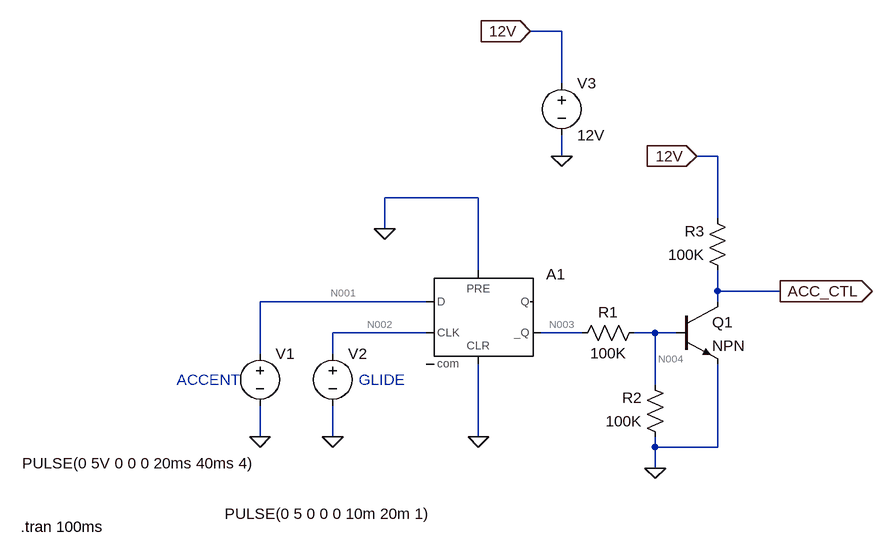
[diagram p0: schematic Accent_1.asc]
Accent_1.asc, the LTspice schematic file:
Version 4
SHEET 1 880 680
WIRE 368 -288 320 -288
WIRE 368 -208 368 -288
WIRE 368 -96 368 -128
WIRE 608 -96 576 -96
WIRE 240 -32 96 -32
WIRE 608 0 608 -96
WIRE 96 16 96 -32
WIRE 240 80 240 -32
WIRE 608 112 608 80
WIRE 704 112 608 112
WIRE 160 128 -96 128
WIRE 608 128 608 112
WIRE 160 176 16 176
WIRE 400 176 336 176
WIRE 512 176 480 176
WIRE 544 176 512 176
WIRE -96 208 -96 128
WIRE 16 208 16 176
WIRE 512 256 512 176
WIRE -96 336 -96 288
WIRE 16 336 16 288
WIRE 240 336 240 224
WIRE 512 352 512 336
WIRE 608 352 608 224
WIRE 608 352 512 352
WIRE 512 384 512 352
FLAG -96 336 0
FLAG 16 336 0
FLAG 240 336 0
FLAG 96 16 0
FLAG 512 384 0
FLAG 368 -96 0
FLAG 320 -288 12V
IOPIN 320 -288 In
FLAG 576 -96 12V
IOPIN 576 -96 In
FLAG 704 112 ACC_CTL
IOPIN 704 112 Out
SYMBOL Digital\\dflop 240 80 R0
WINDOW 3 0 0 Invisible 0
SYMATTR InstName A1
SYMATTR Value Vhigh=5
SYMBOL voltage -96 192 R0
WINDOW 3 -366 185 Left 2
WINDOW 123 0 0 Left 0
WINDOW 39 0 0 Left 0
SYMATTR InstName V1
SYMATTR Value PULSE(0 5V 0 0 0 20ms 40ms 4)
SYMBOL voltage 16 192 R0
WINDOW 3 -166 262 Left 2
WINDOW 123 0 0 Left 0
WINDOW 39 0 0 Left 0
SYMATTR InstName V2
SYMATTR Value PULSE(0 5 0 0 0 10m 20m 1)
SYMBOL res 496 160 R90
WINDOW 0 0 56 VBottom 2
WINDOW 3 32 56 VTop 2
SYMATTR InstName R1
SYMATTR Value 100K
SYMBOL res 528 352 R180
WINDOW 0 36 76 Left 2
WINDOW 3 36 40 Left 2
SYMATTR InstName R2
SYMATTR Value 100K
SYMBOL res 624 96 R180
WINDOW 0 36 76 Left 2
WINDOW 3 36 40 Left 2
SYMATTR InstName R3
SYMATTR Value 100K
SYMBOL npn 544 128 R0
SYMATTR InstName Q1
SYMBOL voltage 368 -224 R0
WINDOW 123 0 0 Left 0
WINDOW 39 0 0 Left 0
SYMATTR InstName V3
SYMATTR Value 12V
TEXT -464 474 Left 2 !.tran 100ms
TEXT -224 248 Left 2 ;ACCENT
TEXT 56 248 Left 2 ;GLIDE

The netlist it stands for:
* Accent_1.asc
A1 N001 0 N002 0 0 N003 0 0 DFLOP Vhigh=5
V1 N001 0 PULSE(0 5V 0 0 0 20ms 40ms 4)
V2 N002 0 PULSE(0 5 0 0 0 10m 20m 1)
R1 N004 N003 100K
R2 0 N004 100K
R3 ACC_CTL 12V 100K
Q1 ACC_CTL N004 0 0 NPN
V3 12V 0 12V
.model NPN NPN
.model PNP PNP
.lib standard.bjt
.tran 100ms
* ACCENT
* GLIDE
.backanno
.end

* Results of the author's LTspice run, read from the files saved beside the schematic
* Operating Point, zero values left out:
*   V(n003) = 5 V
*   V(n004) = 730.8 mV
*   V(acc_ctl) = 44.41 mV
*   V(12v) = 12 V
*   Ic(Q1) = 119.6 µA
*   Ib(Q1) = 35.38 µA
*   Ie(Q1) = -154.9 µA
*   I(R3) = -119.6 µA
*   I(R2) = -7.308 µA
*   I(R1) = -42.69 µA
*   I(V3) = -119.6 µA
*   I8(A1) = 42.69 µA
*   I6(A1) = -42.69 µA
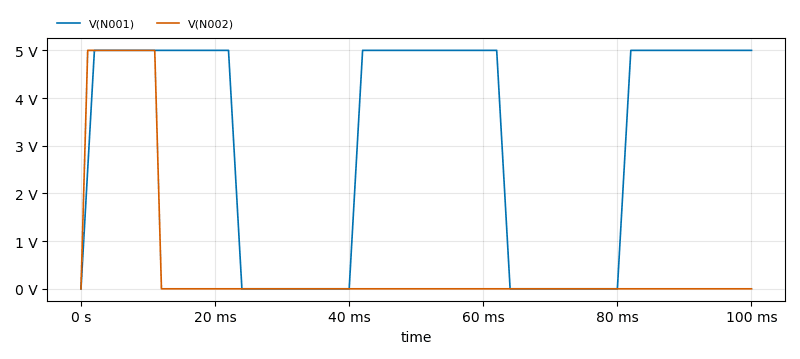
[diagram p1: Transient Analysis of Accent_1.asc, plotted from the saved traces]
* Transient Analysis, 1 run:
*   V(N001): min 0 V, max 5 V, average 3.15 V, rms 3.961 V, last 5 V
*   V(N002): min 0 V, max 5 V, average 550 mV, rms 1.658 V, last 0 V